# Altium schematic sheet Лист 4.SchDoc
size 420 x 297 mm; Address1: Address1; Address2: Address2; Address3: Address3; Address4: Address4; SheetNumber: 1; Scale: 1:1; Разраб.: Иванов; Обозначение документа: АЛ.001.001 Э3; Пров.: Петров; Утв.: Сидоров; Номер листа: 4; Общее количество листов: 5; Масштаб: 1:1; Наименование организации: ОАО "Ваша фирма"; Перв. применение: АБВГ.123456.000; Наименование изделия 3: Схема электрическая принципиальная; Нач. отд.: Нач. отд.; Фамилия нач. отд.: Сидоров
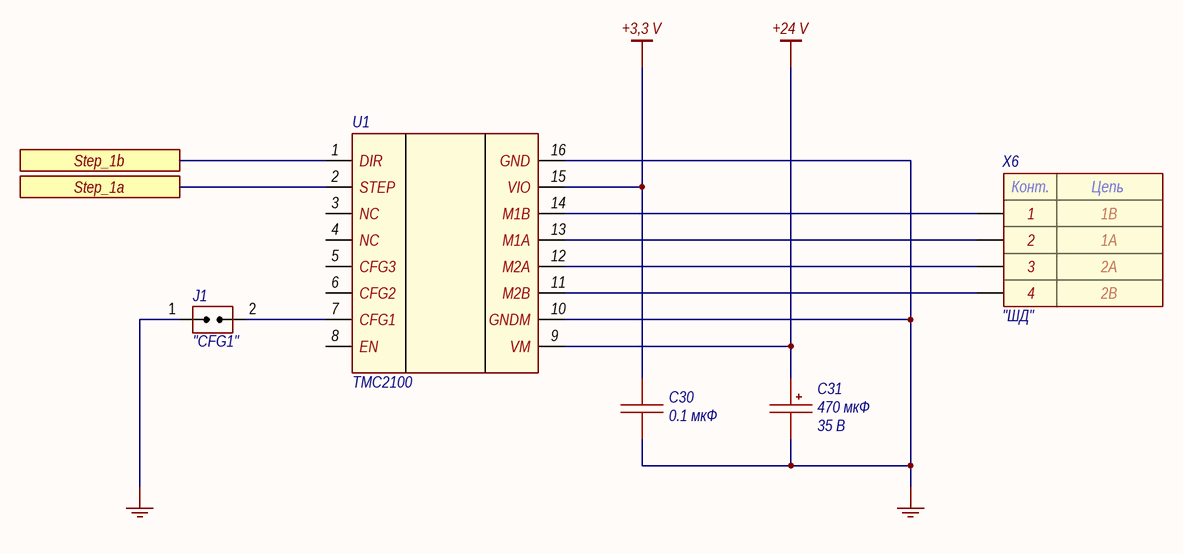
[diagram p0: Лист 4.SchDoc]

## Parts
C30  value 0.1 мкФ  [CAP: 0805]
C31  value 470 мкФ  Voltage: 35 В  [CAP: D10C5H20]
J1  CommentText: "CFG1"  [CON: PLS-2]
U1  TMC2100  [Mod: TMC2100(A4988)]
X6  "ШД"  [CON: B4B-XH-A]

## Ports
Step_1a, Step_1b

## Nets
+3,3 V: C30.2 U1.15(VIO)
+24 V: C31.1 U1.9(VM)
GND: C30.1 C31.2 J1.1(IN) U1.10(GNDM) U1.16(GND)
Step_1a: U1.2(STEP) ; port Step_1a
Step_1b: U1.1(DIR) ; port Step_1b
NetJ1_2: J1.2(IN) U1.7(CFG1)
NetU1_11: U1.11(M2B) X6.4
NetU1_12: U1.12(M2A) X6.3
NetU1_13: U1.13(M1A) X6.2
NetU1_14: U1.14(M1B) X6.1

Not connected (* = marked no-connect by the designer): U1 3(NC) 4(NC) 5(CFG3) 6(CFG2) 8(EN)

## Notes on the sheet
- Подп. и дата
- Инв. № дубл.
- Взам. инв. №
- Инв. № подл.
- Изм.
- Лист
- № докум.
- Подп.
- Дата
- Копировал
- Формат А3
- (in symbol B4B-XH-A) Конт.; Цепь

## Library data of the parts
C30 = Ceramic_0805: Manufacturer: Yageo; PartNumber: CC0805KRX7R7BB104; ValueManufacturerPartNumber: Ceramic capacitor, 0.1 мкФ, X7R, ±10%, 16V, 0805, -55...+125°C; TypeCapacitor: Ceramic capacitor; Tolerance: ±10%; TypeDielectric: X7R; Voltage: 16V; Package: 0805; HelpURL: https://www.digikey.com/product-detail/en/yageo/CC0805KRX7R7BB104/311-1142-1-ND/303052; Temperature: -55...+125°C
C31 = Aluminium: Manufacturer: Wurth; PartNumber: 860080475013; ValueManufacturerPartNumber: Aluminium capacitor, 470 мкФ, 35 В, ±20%, 54mOhm, 14x10x5 mm, -55...+105°C; TypeCapacitor: Aluminium capacitor; Tolerance: ±20%; Impedance: 54mOhm; Package: 14x10x5 mm; HelpURL: https://www.digikey.com/product-detail/en/wurth-electronics-inc/860080475013/732-9029-1-ND/5728972; Temperature: -55...+105°C
J1 = Jumper_single
X6 = B4B-XH-A: Шаг контактов,мм: 2.5 / Количество контактов: 4; Pin_1: 1B; Pin_2: 1A; Pin_3: 2A; Pin_4: 2B